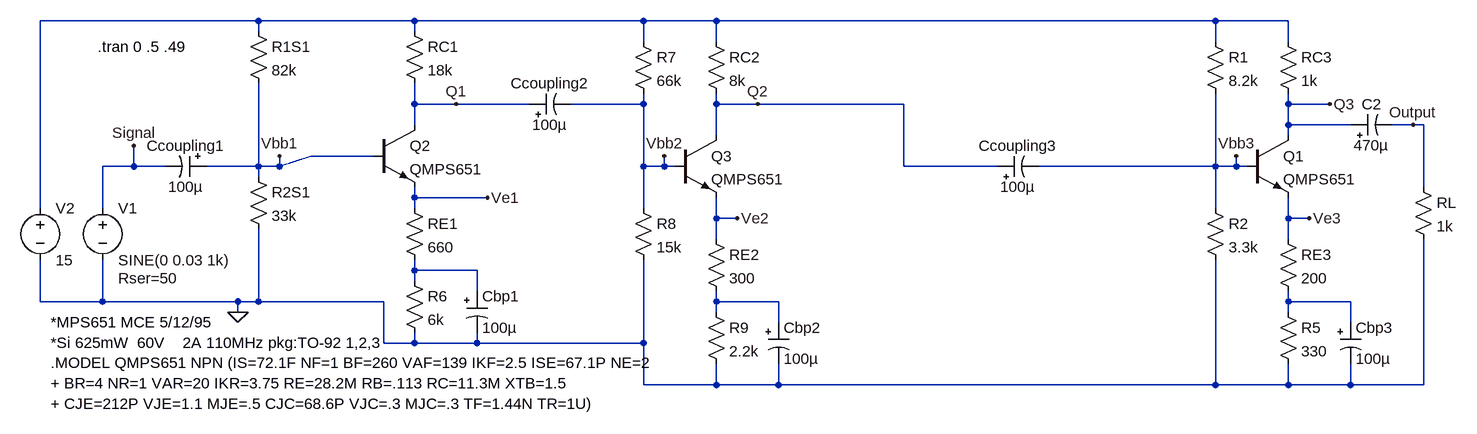
[diagram p0: schematic VDB-3-Stage-MSP651.asc]
VDB-3-Stage-MSP651.asc, the LTspice schematic file:
Version 4
SHEET 1 1516 680
WIRE -400 -336 -736 -336
WIRE -160 -336 -400 -336
WIRE 192 -336 -160 -336
WIRE 304 -336 192 -336
WIRE 1072 -336 304 -336
WIRE 1184 -336 1072 -336
WIRE -400 -320 -400 -336
WIRE -160 -320 -160 -336
WIRE 192 -304 192 -336
WIRE 304 -304 304 -336
WIRE 1072 -304 1072 -336
WIRE 1184 -304 1184 -336
WIRE -160 -208 -160 -240
WIRE -96 -208 -160 -208
WIRE 16 -208 -96 -208
WIRE 192 -208 192 -224
WIRE 192 -208 80 -208
WIRE 304 -208 304 -224
WIRE 368 -208 304 -208
WIRE 592 -208 368 -208
WIRE 1184 -208 1184 -224
WIRE 1248 -208 1184 -208
WIRE -160 -176 -160 -208
WIRE 1184 -176 1184 -208
WIRE 1280 -176 1184 -176
WIRE 1376 -176 1344 -176
WIRE 1392 -176 1376 -176
WIRE 304 -160 304 -208
WIRE 1184 -160 1184 -176
WIRE -224 -128 -320 -128
WIRE -592 -112 -592 -144
WIRE -592 -112 -640 -112
WIRE -544 -112 -592 -112
WIRE -400 -112 -400 -240
WIRE -400 -112 -480 -112
WIRE -368 -112 -368 -128
WIRE -368 -112 -320 -128
WIRE -368 -112 -400 -112
WIRE 192 -112 192 -208
WIRE 224 -112 224 -128
WIRE 224 -112 192 -112
WIRE 240 -112 224 -112
WIRE 592 -112 592 -208
WIRE 736 -112 592 -112
WIRE 1072 -112 1072 -224
WIRE 1072 -112 800 -112
WIRE 1104 -112 1104 -128
WIRE 1104 -112 1072 -112
WIRE 1120 -112 1104 -112
WIRE -400 -96 -400 -112
WIRE 1392 -80 1392 -176
WIRE -160 -64 -160 -80
WIRE -48 -64 -160 -64
WIRE -736 -48 -736 -336
WIRE -640 -48 -640 -112
WIRE -160 -48 -160 -64
WIRE 192 -48 192 -112
WIRE 1072 -48 1072 -112
WIRE 304 -32 304 -64
WIRE 336 -32 304 -32
WIRE 1184 -32 1184 -64
WIRE 1216 -32 1184 -32
WIRE 304 0 304 -32
WIRE 1184 0 1184 -32
WIRE -160 48 -160 32
WIRE -64 48 -160 48
WIRE -160 64 -160 48
WIRE -64 80 -64 48
WIRE -736 96 -736 32
WIRE -640 96 -640 32
WIRE -640 96 -736 96
WIRE -432 96 -640 96
WIRE -400 96 -400 -16
WIRE -400 96 -432 96
WIRE -208 96 -400 96
WIRE 304 96 304 80
WIRE 400 96 304 96
WIRE 1184 96 1184 80
WIRE 1280 96 1184 96
WIRE -432 112 -432 96
WIRE 304 112 304 96
WIRE 1184 112 1184 96
WIRE 400 128 400 96
WIRE 1280 128 1280 96
WIRE -208 160 -208 96
WIRE -160 160 -160 144
WIRE -160 160 -208 160
WIRE -64 160 -64 144
WIRE -64 160 -160 160
WIRE 192 160 192 32
WIRE 192 160 -64 160
WIRE 192 224 192 160
WIRE 304 224 304 192
WIRE 304 224 192 224
WIRE 400 224 400 192
WIRE 400 224 304 224
WIRE 1072 224 1072 32
WIRE 1072 224 400 224
WIRE 1184 224 1184 192
WIRE 1184 224 1072 224
WIRE 1280 224 1280 192
WIRE 1280 224 1184 224
WIRE 1392 224 1392 0
WIRE 1392 224 1280 224
FLAG -592 -144 Signal
FLAG 1104 -128 Vbb3
FLAG 1248 -208 Q3
FLAG 1216 -32 Ve3
FLAG 1376 -176 Output
FLAG -368 -128 Vbb1
FLAG -96 -208 Q1
FLAG -48 -64 Ve1
FLAG 224 -128 Vbb2
FLAG 368 -208 Q2
FLAG 336 -32 Ve2
FLAG -432 112 0
SYMBOL npn 1120 -160 R0
SYMATTR InstName Q1
SYMATTR Value QMPS651
SYMBOL res 1056 -320 R0
SYMATTR InstName R1
SYMATTR Value 8.2k
SYMBOL res 1056 -64 R0
SYMATTR InstName R2
SYMATTR Value 3.3k
SYMBOL res 1168 -320 R0
SYMATTR InstName RC3
SYMATTR Value 1k
SYMBOL res 1168 -16 R0
SYMATTR InstName RE3
SYMATTR Value 200
SYMBOL res 1168 96 R0
SYMATTR InstName R5
SYMATTR Value 330
SYMBOL res 1376 -96 R0
SYMATTR InstName RL
SYMATTR Value 1k
SYMBOL polcap 1280 -160 R270
WINDOW 0 32 32 VTop 2
WINDOW 3 0 32 VBottom 2
SYMATTR InstName C2
SYMATTR Value 470µ
SYMATTR Description Capacitor
SYMATTR Type cap
SYMATTR SpiceLine V=35 Irms=580m Rser=0.12 Lser=0 mfg="Nichicon" pn="UPR1V471MPH" type="Al electrolytic"
SYMBOL polcap 1264 128 R0
WINDOW 3 24 56 Left 2
SYMATTR Value 100µ
SYMATTR InstName Cbp3
SYMATTR Description Capacitor
SYMATTR Type cap
SYMATTR SpiceLine V=25 Irms=145m Rser=0.62 Lser=0 mfg="Nichicon" pn="UPR1E101MPH" type="Al electrolytic"
SYMBOL voltage -640 -64 R0
WINDOW 123 0 0 Left 2
WINDOW 39 24 124 Left 2
SYMATTR SpiceLine Rser=50
SYMATTR InstName V1
SYMATTR Value SINE(0 0.03 1k)
SYMBOL voltage -736 -64 R0
WINDOW 123 0 0 Left 2
WINDOW 39 0 0 Left 2
SYMATTR InstName V2
SYMATTR Value 15
SYMBOL npn -224 -176 R0
SYMATTR InstName Q2
SYMATTR Value QMPS651
SYMBOL res -416 -336 R0
SYMATTR InstName R1S1
SYMATTR Value 82k
SYMBOL res -416 -112 R0
SYMATTR InstName R2S1
SYMATTR Value 33k
SYMBOL res -176 -336 R0
SYMATTR InstName RC1
SYMATTR Value 18k
SYMBOL res -176 -64 R0
SYMATTR InstName RE1
SYMATTR Value 660
SYMBOL polcap -480 -128 R90
WINDOW 0 0 32 VBottom 2
WINDOW 3 32 32 VTop 2
SYMATTR InstName Ccoupling1
SYMATTR Value 100µ
SYMATTR Description Capacitor
SYMATTR Type cap
SYMATTR SpiceLine V=16 Irms=0 Rser=0.9 Lser=0 mfg="AVX" pn="TAJE107K016" type="Tantalum"
SYMBOL npn 240 -160 R0
SYMATTR InstName Q3
SYMATTR Value QMPS651
SYMBOL res 176 -320 R0
SYMATTR InstName R7
SYMATTR Value 66k
SYMBOL res 176 -64 R0
SYMATTR InstName R8
SYMATTR Value 15k
SYMBOL res 288 -320 R0
SYMATTR InstName RC2
SYMATTR Value 8k
SYMBOL res 288 -16 R0
SYMATTR InstName RE2
SYMATTR Value 300
SYMBOL res 288 96 R0
SYMATTR InstName R9
SYMATTR Value 2.2k
SYMBOL polcap 16 -192 R270
WINDOW 0 32 32 VTop 2
WINDOW 3 0 32 VBottom 2
SYMATTR InstName Ccoupling2
SYMATTR Value 100µ
SYMATTR Description Capacitor
SYMATTR Type cap
SYMATTR SpiceLine V=16 Irms=0 Rser=0.9 Lser=0 mfg="AVX" pn="TAJE107K016" type="Tantalum"
SYMBOL polcap 384 128 R0
WINDOW 3 24 56 Left 2
SYMATTR Value 100µ
SYMATTR InstName Cbp2
SYMATTR Description Capacitor
SYMATTR Type cap
SYMATTR SpiceLine V=25 Irms=145m Rser=0.62 Lser=0 mfg="Nichicon" pn="UPR1E101MPH" type="Al electrolytic"
SYMBOL polcap 736 -96 R270
WINDOW 0 32 32 VTop 2
WINDOW 3 0 32 VBottom 2
SYMATTR InstName Ccoupling3
SYMATTR Value 100µ
SYMATTR Description Capacitor
SYMATTR Type cap
SYMATTR SpiceLine V=16 Irms=0 Rser=0.9 Lser=0 mfg="AVX" pn="TAJE107K016" type="Tantalum"
SYMBOL res -176 48 R0
SYMATTR InstName R6
SYMATTR Value 6k
SYMBOL polcap -80 80 R0
WINDOW 3 24 56 Left 2
SYMATTR Value 100µ
SYMATTR InstName Cbp1
SYMATTR Description Capacitor
SYMATTR Type cap
SYMATTR SpiceLine V=25 Irms=145m Rser=0.62 Lser=0 mfg="Nichicon" pn="UPR1E101MPH" type="Al electrolytic"
TEXT -720 128 Left 2 !*MPS651 MCE 5/12/95\n*Si 625mW  60V    2A 110MHz pkg:TO-92 1,2,3\n.MODEL QMPS651 NPN (IS=72.1F NF=1 BF=260 VAF=139 IKF=2.5 ISE=67.1P NE=2\n+ BR=4 NR=1 VAR=20 IKR=3.75 RE=28.2M RB=.113 RC=11.3M XTB=1.5\n+ CJE=212P VJE=1.1 MJE=.5 CJC=68.6P VJC=.3 MJC=.3 TF=1.44N TR=1U)
TEXT -648 -296 Left 2 !.tran 0 .5 .49

The netlist it stands for:
* VDB-3-Stage-MSP651.asc
Q1 Q3 Vbb3 Ve3 0 QMPS651
R1 N001 Vbb3 8.2k
R2 Vbb3 0 3.3k
RC3 N001 Q3 1k
RE3 Ve3 N004 200
R5 N004 0 330
RL Output 0 1k
C2 Q3 Output 470µ V=35 Irms=580m Rser=0.12 Lser=0 mfg="Nichicon" pn="UPR1V471MPH" type="Al electrolytic"
Cbp3 N004 0 100µ V=25 Irms=145m Rser=0.62 Lser=0 mfg="Nichicon" pn="UPR1E101MPH" type="Al electrolytic"
V1 Signal 0 SINE(0 0.03 1k) Rser=50
V2 N001 0 15
Q2 Q1 Vbb1 Ve1 0 QMPS651
R1S1 N001 Vbb1 82k
R2S1 Vbb1 0 33k
RC1 N001 Q1 18k
RE1 Ve1 N002 660
Ccoupling1 Vbb1 Signal 100µ V=16 Irms=0 Rser=0.9 Lser=0 mfg="AVX" pn="TAJE107K016" type="Tantalum"
Q3 Q2 Vbb2 Ve2 0 QMPS651
R7 N001 Vbb2 66k
R8 Vbb2 0 15k
RC2 N001 Q2 8k
RE2 Ve2 N003 300
R9 N003 0 2.2k
Ccoupling2 Q1 Vbb2 100µ V=16 Irms=0 Rser=0.9 Lser=0 mfg="AVX" pn="TAJE107K016" type="Tantalum"
Cbp2 N003 0 100µ V=25 Irms=145m Rser=0.62 Lser=0 mfg="Nichicon" pn="UPR1E101MPH" type="Al electrolytic"
Ccoupling3 Q2 Vbb3 100µ V=16 Irms=0 Rser=0.9 Lser=0 mfg="AVX" pn="TAJE107K016" type="Tantalum"
R6 N002 0 6k
Cbp1 N002 0 100µ V=25 Irms=145m Rser=0.62 Lser=0 mfg="Nichicon" pn="UPR1E101MPH" type="Al electrolytic"
.model NPN NPN
.model PNP PNP
.lib standard.bjt
*MPS651 MCE 5/12/95
*Si 625mW  60V    2A 110MHz pkg:TO-92 1,2,3
.MODEL QMPS651 NPN (IS=72.1F NF=1 BF=260 VAF=139 IKF=2.5 ISE=67.1P NE=2
+ BR=4 NR=1 VAR=20 IKR=3.75 RE=28.2M RB=.113 RC=11.3M XTB=1.5
+ CJE=212P VJE=1.1 MJE=.5 CJC=68.6P VJC=.3 MJC=.3 TF=1.44N TR=1U)
.tran 0 .5 .49
.backanno
.end